# EAGLE design jack_breakout_mult (EAGLE 9.6.0)
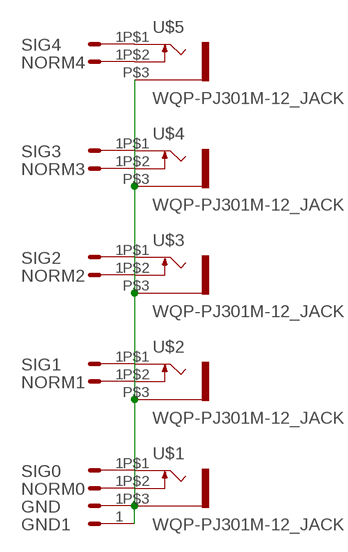
[diagram p0: schematic, sheet 1]

## Parts
GND  HEADER/MALE/01  [HEADER/MALE/01]
GND1  HEADER/MALE/01  [HEADER/MALE/01]
NORM0  HEADER/MALE/01  [HEADER/MALE/01]
NORM1  HEADER/MALE/01  [HEADER/MALE/01]
NORM2  HEADER/MALE/01  [HEADER/MALE/01]
NORM3  HEADER/MALE/01  [HEADER/MALE/01]
NORM4  HEADER/MALE/01  [HEADER/MALE/01]
SIG0  HEADER/MALE/01  [HEADER/MALE/01]
SIG1  HEADER/MALE/01  [HEADER/MALE/01]
SIG2  HEADER/MALE/01  [HEADER/MALE/01]
SIG3  HEADER/MALE/01  [HEADER/MALE/01]
SIG4  HEADER/MALE/01  [HEADER/MALE/01]
U$1  WQP-PJ301M-12_JACK  [WQP-PJ301M-12_JACK]
U$2  WQP-PJ301M-12_JACK  [WQP-PJ301M-12_JACK]
U$3  WQP-PJ301M-12_JACK  [WQP-PJ301M-12_JACK]
U$4  WQP-PJ301M-12_JACK  [WQP-PJ301M-12_JACK]
U$5  WQP-PJ301M-12_JACK  [WQP-PJ301M-12_JACK]

## Nets
N$1: SIG0.1 U$1.P$1
N$2: NORM0.1 U$1.P$2
N$4: SIG1.1 U$2.P$1
N$5: NORM1.1 U$2.P$2
N$6: GND1.1 GND.1 U$1.P$3 U$2.P$3 U$3.P$3 U$4.P$3 U$5.P$3
N$7: SIG2.1 U$3.P$1
N$8: NORM2.1 U$3.P$2
N$9: SIG3.1 U$4.P$1
N$10: NORM3.1 U$4.P$2
N$12: SIG4.1 U$5.P$1
N$13: NORM4.1 U$5.P$2

## Library data of the parts
GND GND1 NORM0 NORM1-NORM4 SIG0 SIG1-SIG4 = connectors:HEADER/MALE/01
U$1-U$5 = controls:WQP-PJ301M-12_JACK

## Board
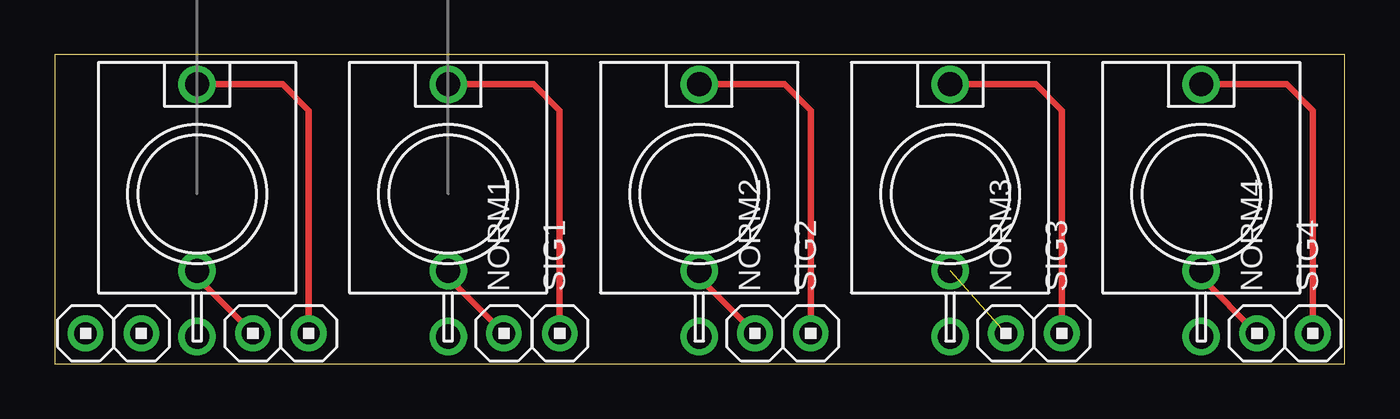
[diagram p1: board, top side]
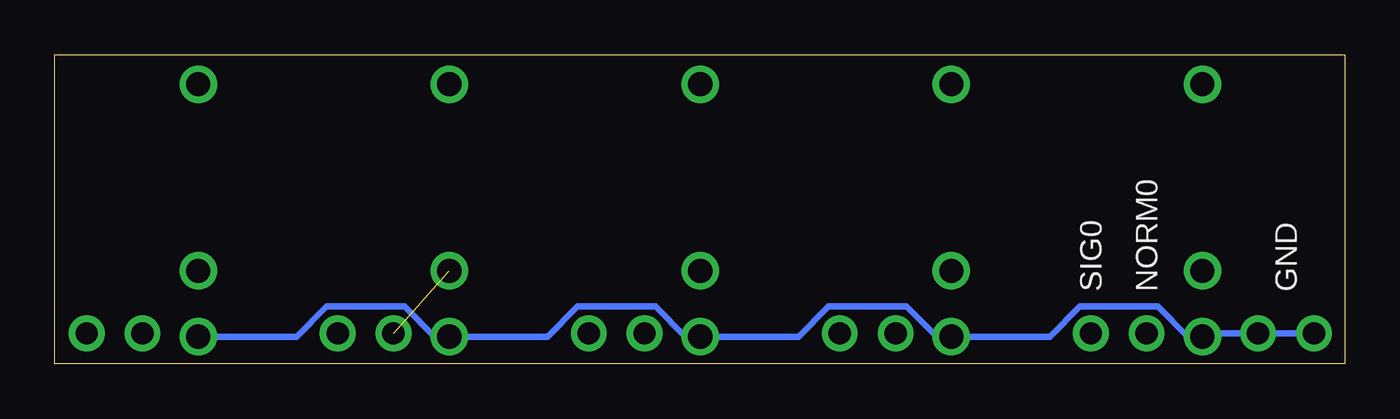
[diagram p2: board, bottom side, seen from below]

Size 58.73 x 14.09 mm. Coordinates in mm from the lower left corner, seen from the top.
Outline: 0,0 58.73,0 58.73,14.09 0,14.09 0,0
Copper layers (1*16): Top 0.0356mm / dielectric 1.5011mm / Bottom 0.0356mm
Design rules "pigatron": minimum track width 12mil, minimum drill 13mil, track to track 15mil, track to pad 10mil, pad to pad 10mil, via to via 10mil, smd to smd 6mil, copper to edge 15mil, drill to drill 10mil, minimum pad ring 12mil, minimum via ring 10mil, stop-mask expansion 4mil, vias tented up to drill 0mil, thermal gap 10mil

### Footprints (pad centres in the part's own frame; a part is rotated, then mirrored left to right if it is on the bottom)
HEADER/MALE/01 = drill 1.016: 1 0,0
WQP-PJ301M-12_JACK = drill 1.1: P$1 0,5; P$2 0,-3.5; P$3 0,-6.5

### Placement (x,y rotation side)
GND  1.4,1.4 90 top
GND1  3.94,1.4 90 top
NORM0  9.02,1.4 90 top
NORM1  20.45,1.4 90 top
NORM2  31.88,1.4 90 top
NORM3  43.31,1.4 90 top
NORM4  54.74,1.4 90 top
SIG0  11.56,1.4 90 top
SIG1  22.99,1.4 90 top
SIG2  34.42,1.4 90 top
SIG3  45.85,1.4 90 top
SIG4  57.28,1.4 90 top
U$1  6.48,7.75 0 top
U$2  17.91,7.75 0 top
U$3  29.34,7.75 0 top
U$4  40.77,7.75 0 top
U$5  52.2,7.75 0 top

### Tracks (layer width: path | path; a pad name or v marks a point on that pad's centre or on a via)
N$1
  Top 0.305: SIG0.1 11.56,11.56 10.37,12.75 U$1.P$1
N$2
  Top 0.305: NORM0.1 6.48,3.94 U$1.P$2
N$4
  Top 0.305: SIG1.1 22.99,11.56 21.8,12.75 U$2.P$1
N$5
  Top 0.305: NORM1.1 17.91,3.94 U$2.P$2
N$6
  Bottom 0.305: GND.1 GND1.1 6.33,1.4 U$1.P$3 7.14,1.25 8.51,2.62 12.06,2.62 13.43,1.25 U$2.P$3 18.57,1.25 19.94,2.62 23.49,2.62 24.86,1.25 U$3.P$3 30,1.25 31.37,2.62 34.92,2.62 36.29,1.25 U$4.P$3 41.43,1.25 42.8,2.62 46.35,2.62 47.72,1.25 U$5.P$3
N$7
  Top 0.305: SIG2.1 34.42,11.56 33.23,12.75 U$3.P$1
N$8
  Top 0.305: NORM2.1 29.34,3.94 U$3.P$2
N$9
  Top 0.305: SIG3.1 45.85,11.56 44.66,12.75 U$4.P$1
N$10  (1 unrouted)
N$12
  Top 0.305: SIG4.1 57.28,11.56 56.09,12.75 U$5.P$1
N$13
  Top 0.305: NORM4.1 52.2,3.94 U$5.P$2